# EasyEDA Pro project ProProject_3516_307_8731_devboard_V1.1_2024-05-14.epro, board 3516aio_v1p1
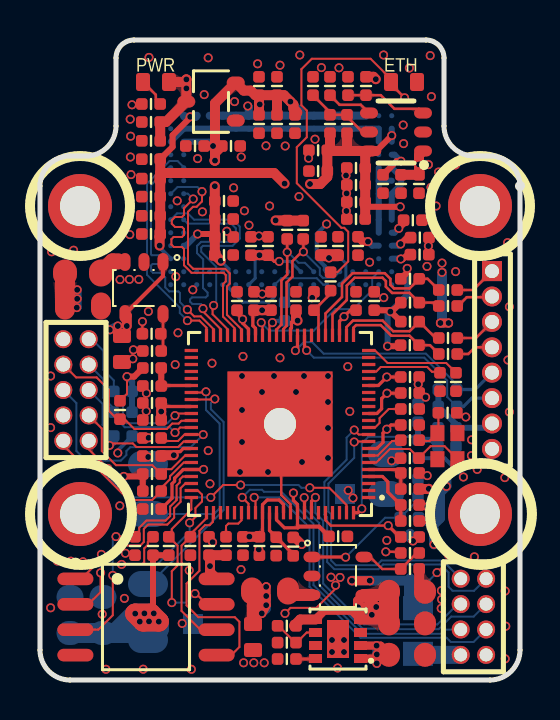
[diagram p1: board, top side]
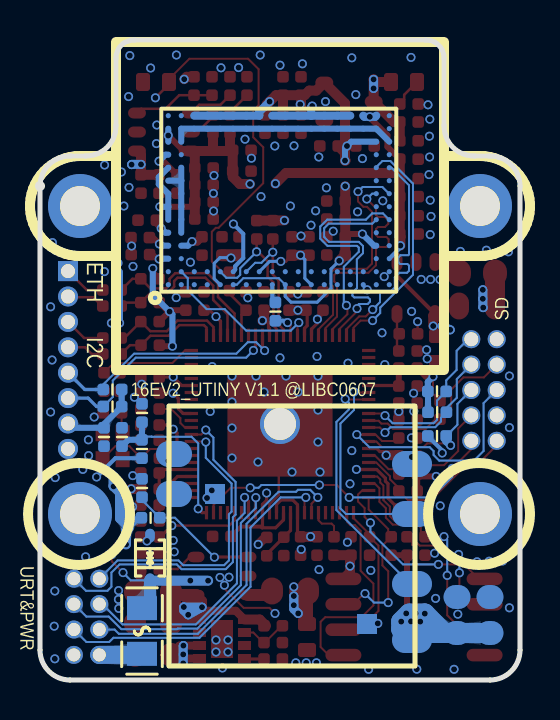
[diagram p2: board, bottom side, seen from below]

Outline 24 x 32 mm; copper layers: Top Layer, Inner1, Inner2, Bottom Layer. Coordinates in mm from the lower left corner of the outline.
Outline path: 0,24.7 arc(0.44,25.76) 1.5,26.2 2.3,26.2 arc(3.36,26.64) 3.8,27.7 3.8,31.1 arc(4.06,31.74) 4.7,32 19.3,32 arc(19.94,31.74) 20.2,31.1 20.2,27.7 arc(20.64,26.64) 21.7,26.2 22.5,26.2 arc(23.56,25.76) 24,24.7 24,1.5 arc(23.56,0.44) 22.5,0 1.5,0 arc(0.44,0.44) 0,1.5 0,24.7
Stack: Top Layer 0.035mm 外层铜厚1oz / Dielectric1 0.2133mm 7628 RC49% 8.6mil / Inner1 0.035mm 内层铜厚 / Dielectric2 0.2133mm 1.1mm H/HOZ 含铜 / Inner2 0.035mm 内层铜厚 / Dielectric3 0.2133mm 7628 RC49% 8.6mil / Bottom Layer 0.035mm 外层铜厚1oz

## Design rules (mm)
template: 自定义配置
spacing copperThickness1oz (default): track to track 0.1, other pairs 0.1 to 0.3
spacing copperThickness2oz: track to track 0.203, other pairs 0.152 to 0.3
track width copperThickness1oz (default): min 0.1, default 0.1, max 2.54
track width copperThickness2oz: min 0.203, default 0.254, max 2.54
differential pair differentialPair (default): width min 0.127, default 0.254, max 2.54; gap min 0.152, default 0.152
via viaSize (default): diameter min 0.45, default 0.5, max 10; hole min 0.3, default 0.305, max 6.3

## Placement (name value [footprint] x y rotation side)
C1  10uF  [0402]  11.55 18.95 90 top
C2  2.2uF  [0402]  18.5 14.35 180 top
C3  2.2uF  [0402]  14.91 7.18 180 top
C5  2.2uF  [0402]  5.6 13.85 0 top
C6  100nF  [0402]  10.7 18.95 270 top
C7  100nF  [0402]  5.6 13 0 top
C8  100nF  [0402]  5.6 8.55 0 top
C9  100nF  [0402]  18.5 10.35 180 top
C10  100nF  [0402]  18.5 8.75 180 top
C11  100nF  [0402]  5.6 11.2 0 top
C12  100nF  [0402]  11.81 6.68 90 top
C13  100nF  [0402]  18.5 15.15 180 top
C14  2.2uF  [0402]  5.6 14.7 0 top
C15  100nF  [0402]  15.8 18.95 270 top
C17  100nF  [0402]  18.5 12.75 180 top
C19  100nF  [0402]  12.8 18.95 270 top
C20  10uF  [0402]  10.97 6.7 270 top
C21  100nF  [0402]  10.15 6.7 90 top
C23  100nF  [0402]  9.85 18.95 270 top
C71  100nF  [0402]  8.45 6.7 270 top
C83  220nF  [0402]  17.15 24.8 90 top
C84  1uF  [0402]  18.99 22.12 180 top
C85  1uF  [0402]  18.64 22.99 180 top
C86  1uF  [0402]  15.9 21.7 90 top
C93  4.7uF  [0402]  9.2 21.25 0 top
C118  18pF  [0402]  14.5 27.8 270 top
C120  10nF  [0402]  14.5 29.7 270 top
C126  100nF  [0402]  10.55 21.7 270 top
C134  4.7uF  [0402]  18.98 21.27 0 top
C136  4.7uF  [0402]  5.55 23.21 180 top
C138  4.7uF  [0402]  15.8 25.6 180 top
C140  4.7uF  [0402]  15.8 23.9 180 top
C148  4.7uF  [0402]  11.4 21.7 90 top
C155  220nF  [0402]  15.4 29.7 270 top
C156  100nF  [0402]  18.05 24.8 90 top
C157  4.7uF  [0402]  18.95 24.8 270 top
C158  100nF  [0402]  13.91 26.48 0 top
C159  4.7uF  [0402]  13.91 25.45 180 top
C160  22uF  [0805#2]  18.35 1.26 0 top
C161  10nF  [0402]  12.34 1.05 0 top
C163  100nF  [0402]  11.85 27.8 90 top
C164  4.7uF  [0402]  10.95 29.7 90 top
C165  4.7uF  [0402]  5.55 27.9 180 top
C166  100nF  [0402]  5.55 26.96 0 top
C167  4.7uF  [0402]  5.55 25.07 180 top
C168  10uF  [0402]  5.55 24.17 180 top
C169  4.7uF  [0402]  7.75 26.7 180 top
C170  4.7uF  [0402]  11.85 29.7 90 top
C172  10nF  [0402]  9.2 22.15 0 top
C173  10nF  [0402]  9.55 26.7 0 top
C174  10uF  [0402]  9.2 23.05 0 top
C175  10nF  [0402]  14.9 21.7 90 top
C176  10uF  [0402]  14.05 21.7 90 top
C177  18pF  [0402]  20.38 13.36 180 top
C178  18pF  [0402]  18.49 11.09 0 top
C183  22uF  [0805#4]  1.5 3.25 90 bottom
C184  22uF  [0805#4]  3.15 3.25 90 bottom
C191  100nF  [0402]  16.71 18.95 90 top
C192  100nF  [0402]  20.4 19.5 0 top
C193  100nF  [0402]  20.4 18.7 0 top
C194  100nF  [0402]  20.4 17.1 0 top
C195  100nF  [0402]  20.4 16.3 0 top
C196  100nF  [0402]  18.5 7.15 0 top
C200  22uF  [0603]  4.1 16.55 90 top
C202  22uF  [0603]  10.65 2.15 90 top
C206  22uF  [0805#2]  18.35 4.41 0 top
C207  22uF  [0805#2]  18.35 2.83 180 top
C208  22uF  [0805]  2.15 18.7 180 top
C209  100nF  [0402]  18.9 13.35 90 bottom
C210  100nF/NC  [0402]  20.8 12.15 90 bottom
C211  100nF  [0402]  18.9 9.6 270 bottom
C212  10nF  [0402]  15.8 24.75 180 top
C213  10nF  [0402]  5.55 22.3 180 top
C214  10nF  [0402]  5.55 26.04 180 top
C215  10nF  [0402]  15.8 23.05 180 top
C216  10nF  [0402]  12.75 27.8 270 top
C217  10nF  [0402]  10.95 27.8 270 top
C218  10nF  [0402]  9.2 23.95 0 top
D2  PESD12VL1BA-N  [sod-323_l1.8-w1.3-ls2.5-bi]  18.5 6.1 270 bottom
F2  BSMD0805-075-12V  [f0805]  18.9 2.45 90 bottom
H1  PM127V-12-08-H43  [hdr-th_8p-p1.27-v-f-r2-c4-s1.27]  21.67 3.16 90 top
L1  -  [0402]  18.5 9.55 180 top
L2  -  [0402]  18.5 7.95 180 top
L3  -  [0402]  12.66 6.67 270 top
L4  -  [0402]  5.6 15.6 180 top
L7  2.2uH  [0805#3]  11.5 4.45 180 top
L8  2.2uH  [0805#4]  2.15 20.35 180 top
LED1  KT-0603R  [0603]  5.8 29.9 0 top
LED2  19-213/Y2C-CQ2R2L/3T(CY)  [0603]  18.2 29.9 180 top
NOREF  -  [Pad_e4285]  12 12.8 90 top
NOREF#2  -  [Pad_e94]  22 8.3 0 top
NOREF#3  -  [Pad_e97]  2 8.3 0 top
R23  4.7kΩ  [0402]  20.8 14.9 90 top
R25  4.7kΩ  [0402]  18.5 13.55 180 top
R27  4.7kΩ  [0402]  5.6 12.1 0 top
R29  4.7kΩ  [0402]  7.52 6.7 90 top
R30  10kΩ  [0402]  9.3 6.7 270 top
R32  4.7kΩ  [0402]  13.7 18.95 270 top
R33  4.7kΩ  [0402]  5.65 6.7 270 top
R34  4.7kΩ  [0402]  6.44 6.7 270 top
R35  4.7kΩ  [0402]  4.75 6.7 90 top
R65  1.5kΩ  [0402]  18.5 11.99 0 top
R74  41.2K  [0402]  15.35 27.8 270 top
R75  30.1K  [0402]  13.65 29.7 270 top
R807  4.7kΩ  [0402]  20 14.9 90 top
R808  4.7kΩ  [0402]  16.3 29.7 270 top
R809  15kΩ  [0402]  12.34 1.87 0 top
R810  47kΩ  [0402]  12.34 2.71 0 top
R811  51kΩ  [0402]  18.5 6.35 180 top
R812  100kΩ  [0402]  18.5 5.55 180 top
R814  100kΩ  [0402]  5.6 16.45 0 top
R815  200kΩ  [0402]  5.58 17.31 180 top
R816  49.9Ω  [0402]  18.5 20.06 0 top
R817  49.9Ω  [0402]  18.5 18.87 0 top
R818  49.9Ω  [0402]  18.5 17.92 0 top
R819  49.9Ω  [0402]  18.49 16.74 0 top
R820  15kΩ  [0402]  19.9 12.15 90 bottom
R821  100kΩ  [0402]  18.9 11.55 270 bottom
R822  1kΩ  [0402]  12.36 22.51 270 top
R823  1kΩ  [0402]  13.16 22.51 270 top
R824  1kΩ/NC  [0402]  20.38 13.67 0 bottom
R825  1kΩ/NC  [0402]  20.38 14.53 0 bottom
R826  4.7kΩ/NC  [0402]  4 13.5 270 top
R827  4.7kΩ/NC  [0402]  4.15 14.43 180 bottom
R828  4.7kΩ/NC  [0402]  5.6 10.3 0 top
R829  4.7kΩ/NC  [0402]  4.15 12.2 180 bottom
R830  4.7kΩ/NC  [0402]  4.14 13.39 180 bottom
R831  4.7kΩ/NC  [0402]  5.6 9.45 0 top
R832  100kΩ  [0402]  18.47 8.11 0 bottom
R833  1kΩ  [0402]  5.55 28.8 180 top
R834  1kΩ  [0402]  14.53 19.93 90 top
R835  49.9Ω  [0402]  12.23 18.42 270 bottom
U1  -  [QFN-88 L9.0-W9.0-P0.35-BL-EP5.26]  12 12.8 90 top
U2  -  [soic-8_l5.3-w5.3-p1.27-ls8.0-bl]  5.3 3.15 270 top
U3  -  [imx307lqd-c__no_ircut]  12 23.7 180 bottom
U11  -  [bl-m8731bu4]  17.55 13.7 180 bottom
U12  TPS82130SILR  [USIP-8_L3.0-W2.8-P0.65-TL-EP]  14.9 2.05 180 top
U13  TPS79301DBVR  [sot-23-6_l2.9-w1.6-p0.95-ls2.8-br]  17.8 27.4 0 top
U14  SY8088AAC  [sot-23-5_l3.0-w1.7-p0.95-ls2.8-br]  14.9 5.2 180 top
U15  SY8088AAC  [sot-23-5_l3.0-w1.7-p0.95-ls2.8-br#2]  5.2 19.6 90 top
U16  ZX-PM1.27-2-5PU  [hdr-th_10p-p1.27-v-f-r2-c5-s1.27]  1.8 14.5 270 top
U17  2343U-108CNG1SNT01  [HDR-TH_8P-P1.27-V-F]  22.6 16 270 top
U18  XC6206P122MR(1uA)  [sot-23-3_l2.9-w1.6-p1.90-ls2.8-br]  8.55 28.92 0 top
X11  24MHz  [CRYSTAL-SMD_4P-L2.0-W1.6-BL]  20.37 11.69 90 top

## Footprints (pads in the part's own frame, mm; a bottom-side part is the same pattern mirrored in y, then rotated)
0402
  custom 0.58x0.58 smd: 1(-0.46,0) 2(0.46,0)
0603
  rrect 0.7x0.9 smd: 1(-0.65,0) 2(0.65,0)
0805
  rrect 1x1.35 smd: 1(-0.9,0) 2(0.9,0)
0805#2
  rrect 1.1x1.2 smd: 1(-0.9,0) 2(0.9,0)
0805#3
  rrect 1.1x1.35 smd: 1(-0.9,0) 2(0.9,0)
0805#4
  rrect 1.2x1.35 smd: 1(-0.9,0) 2(0.9,0)
bl-m8731bu4
  oval 1.8x1.3 smd: 1(0.25,-2.4) 2(0.25,-4.4)
  oval 2x1.3 smd: 3(12.15,-11.7) 4(12.15,-8.9) 5(12.15,-5.4) 6(12.15,-2.9)
  rect 1x1 smd: 7(2.3,-4.4) 8(9.9,-10.9)
CRYSTAL-SMD_4P-L2.0-W1.6-BL
  rect 0.8x0.7 smd: 1(-0.65,-0.5) 2(0.65,-0.5) 3(0.65,0.5) 4(-0.65,0.5)
f0805
  rect 1.2x1.5 smd: 1(-1.143,0) 2(1.143,0)
HDR-TH_8P-P1.27-V-F
  rect 1x1 hole 0.7: 1(-4.445,0)
  round 1 hole 0.7: 2(-3.175,0) 3(-1.905,0) 4(-0.635,0) 5(0.635,0) 6(1.905,0) 7(3.175,0) 8(4.445,0)
hdr-th_8p-p1.27-v-f-r2-c4-s1.27
  round 0.9 hole 0.65: 1(-1.905,-0.635) 2(-1.905,0.635) 3(-0.635,-0.635) 4(-0.635,0.635) 5(0.635,-0.635) 6(0.635,0.635) 7(1.905,-0.635) 8(1.905,0.635)
hdr-th_10p-p1.27-v-f-r2-c5-s1.27
  round 0.9 hole 0.7: 1(-2.54,-0.635) 2(-2.54,0.635) 3(-1.27,-0.635) 4(-1.27,0.635) 5(0,-0.635) 6(0,0.635) 7(1.27,-0.635) 8(1.27,0.635) 9(2.54,-0.635) 10(2.54,0.635)
imx307lqd-c__no_ircut
  round 3.2 hole 2: 0(-10,0) 0(10,0)
  round 0.254 smd: A1(-5.587,-3.934) A2(-5.587,-3.284) A3(-5.587,-2.635) A4(-5.587,-1.984) A5(-5.587,-1.335) A6(-5.587,-0.684) A7(-5.587,-0.035) A8(-5.587,0.616) A9(-5.587,1.266) A10(-5.587,1.915) A11(-5.587,2.566) A12(-5.587,3.216) A13(-5.587,3.865) A14(-5.587,4.516) B1(-4.937,-3.934) B2(-4.937,-3.284) B3(-4.937,-2.635) B4(-4.937,-1.984) B5(-4.937,-1.335) B6(-4.937,-0.684) B7(-4.937,-0.035) B8(-4.937,0.616) B9(-4.937,1.266) B10(-4.937,1.915) B11(-4.937,2.566) B12(-4.937,3.216) B13(-4.937,3.865) B14(-4.937,4.516) C1(-4.287,-3.934) C2(-4.287,-3.284) C13(-4.287,3.865) C14(-4.287,4.516) D1(-3.637,-3.934) D2(-3.637,-3.284) D13(-3.637,3.865) D14(-3.637,4.516) E1(-2.987,-3.934) E2(-2.987,-3.284) E13(-2.987,3.865) E14(-2.987,4.516) F1(-2.337,-3.934) F2(-2.337,-3.284) F13(-2.337,3.865) F14(-2.337,4.516) G1(-1.687,-3.934) G2(-1.687,-3.284) G13(-1.687,3.865) G14(-1.687,4.516) H1(-1.037,-3.934) H2(-1.037,-3.284) H13(-1.037,3.865) H14(-1.037,4.516) J1(-0.387,-3.934) J2(-0.387,-3.284) J13(-0.387,3.865) J14(-0.387,4.516) K1(0.263,-3.934) K2(0.263,-3.284) K13(0.263,3.865) K14(0.263,4.516) L1(0.913,-3.934) L2(0.913,-3.284) L13(0.913,3.865) L14(0.913,4.516) M1(1.563,-3.934) M2(1.563,-3.284) M13(1.563,3.865) M14(1.563,4.516) N1(2.213,-3.934) N2(2.213,-3.284) N13(2.213,3.865) N14(2.213,4.516) P1(2.863,-3.934) P2(2.863,-3.284) P13(2.863,3.865) P14(2.863,4.516) R1(3.513,-3.934) R2(3.513,-3.284) R13(3.513,3.865) R14(3.513,4.516) T1(4.163,-3.934) T2(4.163,-3.284) T13(4.163,3.865) T14(4.163,4.516) U1(4.813,-3.934) U2(4.813,-3.284) U3(4.813,-2.635) U4(4.813,-1.984) U5(4.813,-1.335) U6(4.813,-0.684) U7(4.813,-0.035) U8(4.813,0.616) U9(4.813,1.266) U10(4.813,1.915) U11(4.813,2.566) U12(4.813,3.216) U13(4.813,3.865) U14(4.813,4.516) V1(5.463,-3.934) V2(5.463,-3.284) V3(5.463,-2.635) V4(5.463,-1.984) V5(5.463,-1.335) V6(5.463,-0.684) V7(5.463,-0.035) V8(5.463,0.616) V9(5.463,1.266) V10(5.463,1.915) V11(5.463,2.566) V12(5.463,3.216) V13(5.463,3.865) V14(5.463,4.516)
Pad_e94
  round 3.2 hole 2: 0(0,0)
Pad_e97
  round 3.2 hole 2: 0(0,0)
Pad_e4285
  round 2 hole 1.6: 0(0,0)
QFN-88 L9.0-W9.0-P0.35-BL-EP5.26
  rect 0.16x0.665 smd: 1(-3.675,-4.433) 2(-3.325,-4.433) 3(-2.975,-4.433) 4(-2.625,-4.433) 5(-2.275,-4.433) 6(-1.925,-4.433) 7(-1.575,-4.433) 8(-1.225,-4.433) 9(-0.875,-4.433) 10(-0.525,-4.433) 11(-0.175,-4.433) 12(0.175,-4.433) 13(0.525,-4.433) 14(0.875,-4.433) 15(1.225,-4.433) 16(1.575,-4.433) 17(1.925,-4.433) 18(2.275,-4.433) 19(2.625,-4.433) 20(2.975,-4.433) 21(3.325,-4.433) 22(3.675,-4.433) 45(3.675,4.433) 46(3.325,4.433) 47(2.975,4.433) 48(2.625,4.433) 49(2.275,4.433) 50(1.925,4.433) 51(1.575,4.433) 52(1.225,4.433) 53(0.875,4.433) 54(0.525,4.433) 55(0.175,4.433) 56(-0.175,4.433) 57(-0.525,4.433) 58(-0.875,4.433) 59(-1.225,4.433) 60(-1.575,4.433) 61(-1.925,4.433) 62(-2.275,4.433) 63(-2.625,4.433) 64(-2.975,4.433) 65(-3.325,4.433) 66(-3.675,4.433)
  rect 0.665x0.16 smd: 23(4.433,-3.675) 24(4.433,-3.325) 25(4.433,-2.975) 26(4.433,-2.625) 27(4.433,-2.275) 28(4.433,-1.925) 29(4.433,-1.575) 30(4.433,-1.225) 31(4.433,-0.875) 32(4.433,-0.525) 33(4.433,-0.175) 34(4.433,0.175) 35(4.433,0.525) 36(4.433,0.875) 37(4.433,1.225) 38(4.433,1.575) 39(4.433,1.925) 40(4.433,2.275) 41(4.433,2.625) 42(4.433,2.975) 43(4.433,3.325) 44(4.433,3.675) 67(-4.433,3.675) 68(-4.433,3.325) 69(-4.433,2.975) 70(-4.433,2.625) 71(-4.433,2.275) 72(-4.433,1.925) 73(-4.433,1.575) 74(-4.433,1.225) 75(-4.433,0.875) 76(-4.433,0.525) 77(-4.433,0.175) 78(-4.433,-0.175) 79(-4.433,-0.525) 80(-4.433,-0.875) 81(-4.433,-1.225) 82(-4.433,-1.575) 83(-4.433,-1.925) 84(-4.433,-2.275) 85(-4.433,-2.625) 86(-4.433,-2.975) 87(-4.433,-3.325) 88(-4.433,-3.675)
  rect 5.26x5.26 smd: 89(0,0)
sod-323_l1.8-w1.3-ls2.5-bi
  rrect 0.7x0.49 smd: 1(-1.117,0) 2(1.117,0)
soic-8_l5.3-w5.3-p1.27-ls8.0-bl
  oval 0.63x1.8 smd: 1(-1.905,-3.53) 2(-0.635,-3.53) 3(0.635,-3.53) 4(1.905,-3.53) 5(1.905,3.53) 6(0.635,3.53) 7(-0.635,3.53) 8(-1.905,3.53)
sot-23-3_l2.9-w1.6-p1.90-ls2.8-br
  rrect 0.9x0.6 smd: 1(1.235,-0.95) 2(1.235,0.95) 3(-1.235,0)
sot-23-5_l3.0-w1.7-p0.95-ls2.8-br
  rrect 0.85x0.53 smd: 1(1.3,-0.95) 2(1.3,0) 3(1.3,0.95) 4(-1.3,0.95) 5(-1.3,-0.95)
sot-23-5_l3.0-w1.7-p0.95-ls2.8-br#2
  rrect 0.9x0.55 smd: 1(1.3,-0.95) 2(1.3,0) 3(1.3,0.95) 4(-1.3,0.95) 5(-1.3,-0.95)
sot-23-6_l2.9-w1.6-p0.95-ls2.8-br
  rrect 0.9x0.55 smd: 1(1.35,-0.95) 2(1.35,0) 3(1.35,0.95) 4(-1.35,0.95) 5(-1.35,0) 6(-1.35,-0.95)
USIP-8_L3.0-W2.8-P0.65-TL-EP
  rect 0.65x0.45 smd: 1(-1.125,0.975) 2(-1.125,0.325) 3(-1.125,-0.325) 4(-1.125,-0.975) 5(1.125,-0.975) 6(1.125,-0.325) 7(1.125,0.325) 8(1.125,0.975)
  rect 1.1x1.9 smd: 9(0,0)

## Nets
As in the schematic, except:
GND: C1.2 C2.1 C3.1 C5.1 C6.1 C7.1 C8.1 C9.1 C10.1 C11.1 C12.1 C13.1 C14.1 C15.1 C17.1 C19.1 C20.2 C21.1 C23.1 C71.1 C83.1 C84.1 C85.1 C86.1 C93.2 C120.1 C126.1 C134.2 C136.2 C138.2 C140.2 C148.2 C155.1 C156.1 C157.2 C158.1 C159.2 C160.2 C161.1 C163.1 C164.2 C165.2 C166.1 C167.2 C168.2 C169.2 C170.2 C172.2 C173.2 C174.2 C175.2 C176.2 C177.1 C178.1 C183.2 C184.2 C191.2 C196.2 C200.1 C202.1 C206.2 C207.1 C208.1 C209.2 C210.1 C211.1 C212.2 C213.2 C214.2 C215.2 C216.2 C217.2 C218.2 D2.1 H1.1 LED2.1 NOREF.0 NOREF#2.0 NOREF#3.0 R23.1 R25.1 R27.1 R29.1 R32.1 R35.1 R75.1 R807.1 R809.1 R812.1 R814.1 R820.2 R833.2 U1.45 U1.47 U1.79 U1.89 U2.4 U3.0 U3.A9 U3.B3 U3.B5 U3.B6 U3.B7 U3.B8 U3.B9 U3.B10 U3.B12 U3.B13 U3.C1 U3.C13 U3.D2 U3.D13 U3.E13 U3.F2 U3.F13 U3.G13 U3.H13 U3.J13 U3.K2 U3.K13 U3.L13 U3.M2 U3.M13 U3.N13 U3.P13 U3.R13 U3.T2 U3.T13 U3.U3 U3.U7 U3.U9 U3.U13 U3.V2 U3.V4 U3.V7 U3.V9 U3.V12 U11.1 U11.6 U11.7 U11.8 U12.3 U12.9 U13.2 U14.2 U15.2 U16.7 U17.8 U18.1 X11.2 X11.4

Pads without a net: U1 1 2 3 12 14 15 16 18 20 21 29 46 48 49 69 70 83 85 86; U3 A1 A2 A14 B1 B11 B14 C2 D1 G1 H1 J2 L1 L2 N1 N2 P1 P2 R1 R2 U1 U2 U5 U11 V1 V5 V11 V13 V14; U11 2; U12 7

## Via types
v1: diameter 0.45, hole 0.3, Top Layer to Bottom Layer, 274 vias

## Routing (per net, layer and track width the routed paths; a pad name or vN(x,y) marks a point on that pad's centre or on a via; arc(x,y) is an arc through that point)
0V9: length 69.8
  Top Layer w0.12: R811.2 17.98,6.41 v1(17.29,6.41)
  Top Layer w0.16: U1.37 10.78,17.58 10.64,17.72 10.64,18.43 C6.2 ; v1(12.67,9.35) 12.67,8.98 12.88,8.78 U1.80 12.88,7.63 12.9,7.61 12.22,7.61 11.82,8.01 U1.77 ; U1.13 16.84,13.33 17.08,13.56 17.08,14.07 v1(17.35,14.34) 18.03,14.34 C2.2 ; U1.53 6.24,13.67 C5.2 ; C8.2 6.6,9.09 6.6,9.81 6.73,9.94 6.73,10.09 7.16,10.53 U1.62 8.18,10.53 v1(8.18,10.53)
  Top Layer w0.2: C3.2 13.96,7.67 12.91,7.67 12.88,7.63
  Top Layer w0.45: v1(11.09,3.33) v1(11.31,3.74) 11.31,4.06 10.9,3.65 ; v1(11.31,4.66) v1(11.31,4.2)
  Top Layer w0.5: C7.2 v1(6.06,13.42) C5.2 ; L1.1 19.43,9.55 v1(19.44,9.56) ; C1.1 v1(11.1,18.49) C6.2
  Top Layer w0.6: C202.2 10.65,4.2 10.6,4.25
  Inner2 w0.2: 11.76,5.75 14.29,5.75 15.15,6.61 15.95,6.61 16.15,6.41 v1(17.29,6.41)
  Inner2 w0.5: 7.55,10.58 7.55,9.04 11.31,5.28 v1(11.31,4.66) ; 7.55,10.58 7.6,10.53 v1(8.18,10.53) ; 7.55,10.58 7.55,13.61 7.26,13.9 6.53,13.9 v1(6.06,13.42) ; v1(17.35,14.34) 17.32,14.37 16.57,14.37 16.56,14.38 16.56,16.53 15.8,17.29 12.62,17.29 12.26,17.65 12.26,18.26 12.03,18.49 v1(11.1,18.49)
  Inner2 w0.6: v1(11.09,3.33) 11.31,3.55 v1(11.31,4.2) ; 12.67,9.43 12.67,9.88 13.04,10.25 14.58,10.25 ; v1(19.44,9.56) 17.25,9.56 16.56,10.25
  Inner2 w0.8: 16.56,14.38 16.56,10.25 14.58,10.25 14.5,10.17 14.5,8.81 13.77,8.08 12.97,8.08 11.76,6.87 11.76,5.11 v1(11.31,4.66)
  Bottom Layer w0.45: v1(11.09,3.33) 11.31,3.55 v1(11.31,3.74) v1(11.31,4.2)
1V2_SNS: length 51.8
  Top Layer w0.3: C172.1 8.59,22.3 v1(7.88,22.3) ; 18.44,21.34 18.15,21.05 v1(18.04,21.05)
  Top Layer w0.4: C173.1 v1(8.65,26.7) C169.1
  Top Layer w0.5: v1(8.74,24.69) C218.1 C174.1 C172.1 8.74,21.26 v1(9.04,20.96) ; 12.87,28.38 12.67,28.57 12.67,28.77 v1(12.52,28.92) 12.2,29.24 C170.1 ; C164.1 C217.1 ; 8.72,25.98 8.73,25.97 v1(8.75,25.97) 8.75,26.36 ; C170.1 C163.2 ; C170.1 10.77,29.24 10.54,29.47 10.19,29.47 9.78,29.87 8.75,28.84 8.75,26.36 ; 8.75,26.36 C173.1
  Inner2 w0.3: v1(18.04,21.05) 17.69,21.4 14.98,21.4 10.7,25.68 10.7,28.49 10.91,28.7
  Inner2 w0.45: v1(10.39,28.7) 10.91,28.7 v1(10.99,28.78) ; v1(8.74,24.69) 8.74,25.96 v1(8.75,25.97) 8.75,26.6 v1(8.65,26.7)
  Bottom Layer w0.1: U3.K1 12.06,20.09 13.84,20.09 14.16,19.77 U3.F1
  Bottom Layer w0.15: U3.K1 11.74,19.18 11.45,18.89 10.14,18.89 9.45,19.58 9.45,20.55 v1(9.04,20.96)
  Bottom Layer w0.3: v1(7.88,22.3) 7.3,21.72 U3.U4 ; U3.A3 18.02,21.07 v1(18.04,21.05) ; v1(8.75,25.97) 8.75,26.6 v1(8.65,26.7) 8.44,26.92 U3.U12
  Bottom Layer w0.4: v1(10.39,28.7) 10.44,28.65 U3.M14 ; v1(12.52,28.92) 13.04,28.4 U3.H14 U3.G14 U3.F14 U3.E14 U3.D14 U3.C14 ; U3.M14 U3.N14 U3.P14 U3.R14 ; U3.M14 U3.L14 U3.K14 U3.J14
1V8: length 75.7
  Top Layer w0.127: R815.2 v1(5.12,17.92)
  Top Layer w0.15: v1(11.96,20.93) 11.71,20.93 C148.1
  Top Layer w0.16: C23.2 9.85,18.32 v1(10.13,18.04) 10.13,17.84 10.43,17.55 U1.38 ; U1.78 12.18,8.78 11.95,9 11.36,9 11.12,8.77 U1.75 11.12,7.39 10.91,7.17 v1(10.47,7.17) 10.46,7.16 ; U1.32 12.53,17.56 12.57,17.61 12.57,17.89 12.8,17.89 v1(12.88,17.97)
  Top Layer w0.5: R823.1 R822.1 12.35,22.98 v1(11.78,22.98) ; C148.1 v1(10.97,21.24) C126.2 ; 10.1,7.16 10.9,7.16 ; C19.2 12.8,18.05 v1(12.88,17.97)
  Top Layer w0.6: C176.1 C175.1
  Top Layer w1: L8.2 C208.2
  Inner2 w0.2: v1(1.84,18.62) 4.42,18.62 v1(5.12,17.92)
  Inner2 w0.5: 11.78,21.11 v1(11.96,20.93) 12.02,20.87 12.02,19.51 ; 11.78,21.11 v1(11.78,22.98) ; 11.78,21.11 11.65,21.24 v1(10.97,21.24) 10.11,20.38 10.11,19.51 10.13,19.49 v1(10.13,18.04) ; 14.66,19.75 19.87,19.75 21.53,18.09 21.53,13.89 U17.7 ; v1(12.88,17.97) 12.88,19.46 ; 12.88,19.46 12.83,19.51 ; 12.88,19.46 13.14,19.72 14.45,19.72 v1(14.45,21.1) ; 9.34,19.51 9.36,19.49 9.36,8.28 v1(10.47,7.17)
  Inner2 w0.8: v1(1.86,19.51) 2.08,19.29 7.42,19.29 v1(7.64,19.51) 10.11,19.51 ; 12.02,19.51 12.83,19.51
  Bottom Layer w0.15: U3.T1 7.84,19.71 v1(7.64,19.51) ; U3.H2 12.52,20.93 v1(11.96,20.93) ; v1(14.45,21.1) 14.47,21.12 15,21.12 15.29,20.83 15.29,20.07 U3.E1 ; U3.M1 10.76,20.09 10.76,21.03 v1(10.97,21.24)
  Bottom Layer w0.3: R825.1 R824.1 20.8,12.79 C210.2 22.38,12.61 U17.7
  Bottom Layer w0.45: v1(1.86,19.51) v1(1.86,19.06) 1.86,18.64 v1(1.84,18.62)
2V9_SNS: length 33.6
  Top Layer w0.3: C214.1 6.63,26.66 6.63,27.24 7.51,28.12 v1(7.51,28.16) ; v1(17.59,27.22) 16.81,26.45 ; 16.26,23.66 v1(18.01,23.66)
  Top Layer w0.5: v1(12.23,24.82) 11.7,25.35 6.01,25.35 ; 6.01,25.35 C214.1 6.01,26.09 ; 6.01,25.35 C167.1 C213.1 ; C158.2 14.4,26.45 15.36,26.45 ; C158.2 14.5,26.62 C118.2 ; C158.2 14.37,25.16 14.01,24.8 v1(13.5,24.8) ; 15.36,26.45 U13.6 ; 15.36,26.45 15.35,26.46 R74.2 ; C215.1 C140.1 C212.1 C138.1 16.26,26.26 U13.6 ; 5.98,22.15 6.01,22.18 C213.1 ; 5.98,22.15 v1(5.98,21.72) ; 5.98,22.15 C213.1 ; U13.6 16.81,26.45
  Inner2 w0.45: v1(13.5,24.8) 13.48,24.82 v1(12.23,24.82)
  Bottom Layer w0.2: v1(5.98,21.72) 5.98,21.62 U3.V3
  Bottom Layer w0.3: U3.A10 18.06,25.14 18.06,24.79 U3.A8 U3.A7 ; U3.A12 v1(17.59,27.22) U3.A13 ; v1(18.01,23.66) 17.59,23.66 U3.A7 ; U3.A7 U3.A6
  Bottom Layer w0.4: U3.U14 7.24,28.16 v1(7.51,28.16) 7.78,28.16 U3.T14
3V3: length 176.7
  Top Layer w0.1: v1(4.35,15.17) 4.35,14.31 4.14,14.1
  Top Layer w0.12: v1(17.41,7.72) 14.54,7.72 14.28,7.98 U1.84
  Top Layer w0.16: U1.59 7.16,11.58 7.01,11.42 6.71,11.42 ; C13.2 v1(17.34,15.15) 16.91,14.73 U1.17 ; v1(17.41,7.72) 17.98,7.15 C196.1 ; L2.1 19.24,7.95 v1(19.55,7.64) ; U1.8 16.84,11.58 17.15,11.88 17.15,12.35 v1(17.34,12.54) 17.55,12.75 C17.2 ; C15.2 15.52,18.49 v1(15.2,18.17) 14.97,17.95 U1.25
  Top Layer w0.2: U15.1 6.15,20.2 U15.4
  Top Layer w0.3: R34.2 R33.2 5.65,3.37 v1(5.69,3.33) ; L4.2 4.71,15.17 v1(4.35,15.17) ; R831.1 R828.1 5.02,10.18 v1(4.19,10.18)
  Top Layer w0.4: U12.5 14.21,3.46 15.59,3.46 U12.4
  Top Layer w0.45: v1(20.02,17.85) v1(20.43,17.85) ; L3.1 12.74,7.13 v1(13.09,6.78)
  Top Layer w0.5: 17.28,3.03 16.81,3.49 v1(16.81,3.65) ; 17.28,3.03 17.45,2.85 ; 17.28,3.03 U12.4 16.03,3.52 v1(15.9,3.64) 15.9,3.95 U14.4 ; LED1.2 7.19,29.9 7.31,30.03 ; v1(16.81,3.65) 16.21,4.25 ; v1(16.81,3.65) 16.8,3.64 16.21,3.64 ; v1(6.69,11.24) 6.1,11.24 C11.2 ; U12.5 13.01,3.03 12.7,2.71 ; 7.31,30.03 v1(7.32,30.03) ; 7.31,30.03 U18.3 6.29,27.9 C165.1 6.01,27.05 ; v1(16.79,30.04) 16.67,30.16 R808.1 ; U13.1 18.95,26.25 v1(18.95,25.78) C157.1 C156.2 ; U2.8 8.5,5.39 v1(8.5,5.7) 8.5,6.24 R30.2 ; U15.4 4.34,18.21 v1(4.34,17.7)
  Top Layer w0.6: 17.45,4.4 17.3,4.25 U14.4
  Top Layer w1: 17.45,4.4 17.45,2.85 ; 5.16,2.92 v1(5.94,2.92) 5.54,3.32 v1(4.76,3.32) 5.16,2.92
  Inner1 w0.8: v1(19.55,7.64) 19.55,6.47 18.62,5.54 18.62,4.81 17.46,3.65 v1(16.81,3.65) 16.8,3.64 v1(15.9,3.64) 16.28,3.26 v1(16.59,3.26)
  Inner2 w0.3: 4.57,11.24 4.95,11.62 6.31,11.62 v1(6.69,11.24)
  Inner2 w0.45: v1(20.1,20.85) v1(20.1,20.38) ; 4.35,11.81 v1(3.89,11.35)
  Inner2 w0.5: v1(7.32,30.03) 16.78,30.03 v1(16.79,30.04) 16.79,25.41 16.89,25.31 18.28,25.31 ; v1(17.34,15.15) 17.81,15.15 18.17,14.79 ; 18.17,14.79 18.17,13.37 ; 18.17,14.79 18.17,16.8 17.44,17.53 16.94,17.53 16.3,18.17 v1(15.2,18.17) ; v1(19.42,25.77) 18.74,25.77 18.28,25.31 ; v1(4.34,17.7) 4.15,17.89 2.01,17.89 1.16,17.04 ; 18.28,25.31 18.28,24.24 20.1,22.42 v1(20.1,20.85) ; 18.17,13.37 v1(17.34,12.54) ; 18.17,13.37 20.08,13.37 20.13,13.42
  Inner2 w0.6: 4.57,11.24 4.35,11.46 v1(4.35,15.17) 3.96,15.56 3.96,17.32 v1(4.34,17.7) 3.68,17.7 v1(3.49,17.51)
  Inner2 w0.8: v1(20.02,17.85) 20.13,17.74 20.13,13.42 ; v1(19.55,7.64) 19.47,7.72 v1(17.41,7.72) 15.16,7.72 14.36,6.92 13.23,6.92 v1(13.09,6.78) ; v1(5.94,2.92) 5.94,3.08 v1(5.69,3.33) 5.68,3.32 v1(4.76,3.32) 4.99,3.09 v1(4.99,2.92) v1(5.94,2.92) ; v1(5.94,2.92) 7.05,1.81 12.85,1.81 13.94,2.9 16.14,2.9 16.71,3.47 16.71,3.65 13.92,3.65 12.38,2.11 9.64,2.11 9.64,4.35 4.16,9.83 4.16,10.83 4.57,11.24 ; 20.32,13.14 v1(20.32,10.17)
  Bottom Layer w0.2: v1(3.89,11.35) 3.89,11.48 R829.1
  Bottom Layer w0.3: R832.2 19.08,8.11 v1(19.55,7.64) ; v1(4.35,15.17) 4.61,14.91 R827.1 4.6,14.42 R830.1
  Bottom Layer w0.45: v1(18.95,25.78) 19.41,25.78 v1(19.42,25.77) ; v1(7.32,30.03) v1(7.32,29.58) ; v1(3.49,17.51) v1(3.89,17.7) ; 16.8,3.64 v1(16.81,3.65) 16.81,3.48 v1(16.59,3.26) v1(15.9,3.64) 16.8,3.64
  Bottom Layer w0.5: v1(20.32,10.17) 20.32,9.7 ; 20.32,9.7 v1(20.32,9.68) ; 20.32,9.7 20,9.38 20,8.09 v1(19.55,7.64) 19.7,7.49 v1(19.7,6.78) ; 20.09,17.85 20.1,17.86 v1(20.1,20.38)
  Bottom Layer w1: v1(4.76,3.32) 5.54,3.32 v1(5.94,2.92) 5.94,2.54 U11.3 ; v1(4.76,3.32) 3.79,2.35 ; v1(4.76,3.32) 5.4,2.68 U11.3 ; U11.3 5.05,2.35 3.79,2.35 ; C183.1 C184.1 3.79,2.35
  vias: v1(5.22,3.33) v1(5.45,2.93) v1(19.71,7.23)
AVDD33_DDR_PLL: length 2.6
  Top Layer w0.16: U1.76 11.47,7.48 C12.2 12.66,6.29 L3.2
AVDD33_PLL: length 3.3
  Top Layer w0.16: U1.4 17.12,10.17 17.39,9.91 17.39,9.4 C10.2 L2.2
AVDD_PLL: length 2.5
  Top Layer w0.16: L1.2 C9.2 17.87,10.53 U1.5
GND: length 27.1
  Top Layer w0.1: v1(14.78,4.74) 14.78,4.57 13.81,3.61 12.53,3.61 v1(12.25,3.33)
  Top Layer w0.12: U1.79 12.53,8.78 12.06,9.25 12.06,12.74 U1.89
  Top Layer w0.5: R812.1 18.96,4.69 19.25,4.4
  Bottom Layer w0.2: U3.F2 14.24,20.51 14.24,20.69 13.84,21.1 13.84,22.31 v1(14.33,22.8)
  Bottom Layer w0.3: U3.B12 U3.B13 U3.C13 U3.D13 U3.E13 U3.F13 U3.G13 U3.H13 U3.J13 U3.K13 U3.L13 U3.M13 U3.N13 U3.P13 U3.R13 U3.T13 U3.U13 U3.V12 ; U3.B9 U3.B8 U3.B7 U3.B6 U3.B5 ; U3.B9 U3.B10 ; U3.B9 U3.A9
  vias: v1(0.53,15.2) v1(0.53,12.62) v1(0.53,3.61) v1(0.58,21.41) v1(0.74,10.51) v1(0.87,5.95) v1(1.54,5.94) v1(1.68,21.49) v1(2.15,5.91) v1(2.98,21.43) v1(3.11,3.29) v1(3.3,0.53) v1(4,20.02) v1(3.99,8.71) v1(4.22,4.08) v1(4.27,6.34) v1(4.45,23.18) v1(4.51,28.04) v1(4.53,27.19) v1(4.52,26.15) v1(4.49,23.99) v1(4.49,22.27) v1(4.47,20.03) v1(4.6,28.76) v1(4.55,25.27) v1(4.64,16.06) v1(4.67,16.51) v1(4.94,20.03) v1(5.16,0.54) v1(5.32,14.34) v1(5.31,13.44) v1(5.45,31.13) v1(5.42,18.43) v1(5.43,12.11) v1(5.41,11.15) v1(6.79,20.17) v1(6.76,15.77) v1(6.86,23.96) v1(6.9,17.36) v1(7.11,2.83) v1(7.46,5.48) v1(7.57,0.53) v1(7.88,26.07) v1(8.12,23.41) v1(8.21,29.27) v1(8.41,31.11) v1(8.41,11.47) v1(8.5,9.81) v1(8.6,15.84) v1(8.63,6.89) v1(9.34,22.44) v1(9.73,28.92) v1(9.68,24.61) v1(10,10.4) v1(10.06,26.15) v1(10.1,15.2) v1(10.1,13.5) v1(10.1,11.9) v1(10.05,5.52) v1(10.22,23.46) v1(10.15,16.18) v1(10.18,0.86) v1(10.45,22.74) v1(10.69,0.86) v1(10.88,30.81) v1(10.95,22.2) v1(10.94,6.53) v1(11.11,19.3) v1(11.1,14.4) v1(11.21,0.86) v1(11.3,26.71) v1(11.4,10.4) v1(11.48,23.7) v1(11.7,15.2) v1(12,30.74) v1(12,16.11) v1(12.26,26.7) v1(12.8,14.4) v1(12.95,24.17) v1(12.99,31.25) v1(13.1,10.9) v1(13.2,15.2) v1(13.43,26.09) v1(13.61,19.11) v1(13.75,27.04) v1(14.07,30.62) v1(14.4,15.2) v1(14.4,13.9) v1(14.4,12.6) v1(14.4,11.1) v1(14.55,5.14) v1(14.6,2) v1(14.6,1.4) v1(14.95,30.61) v1(14.88,0.6) v1(15,5.13) v1(15.2,2) v1(15.2,1.4) v1(15.3,25.23) v1(15.33,24.33) v1(15.32,23.45) v1(15.39,15.67) v1(15.41,9.48) v1(15.49,13.43) v1(15.65,9.1) v1(16.48,20.89) v1(17.18,31.25) v1(17.19,19.12) v1(17.34,6.98) v1(17.58,10.96) v1(18.16,27.75) v1(18.18,26.82) v1(18.47,30.6) v1(18.65,6.95) v1(18.91,14.79) v1(19.35,20.68) v1(19.28,14.14) v1(19.42,21.7) v1(19.36,10.22) v1(19.37,8.66) v1(19.51,31.22) v1(19.57,29.17) v1(19.55,24.63) v1(19.81,23.7) v1(19.93,25.4) v1(20.07,4.47) v1(20.08,4.03) v1(20.06,3.58) v1(20.77,25.75) v1(20.78,20.42) v1(21.29,13.15) v1(21.58,12.01) v1(21.57,11.22) v1(21.72,6.16) v1(21.86,10.53) v1(23.24,10.12) v1(23.26,4.45) v1(23.29,2.69) v1(23.26,1.06) v1(23.38,21.87) v1(23.4,16) v1(23.47,18.66) v1(23.47,13.4)
VIN: length 25
  Top Layer w0.1: v1(20.41,6.27) 20.41,5.93 v1(19.85,5.37)
  Top Layer w0.4: U12.1 17.22,1.08 17.45,1.3 17.03,1.72 v1(16.83,1.72) 16.03,1.72 U12.2
  Top Layer w0.45: v1(16.49,4.97) 16.48,4.97 v1(15.59,4.97)
  Inner1 w0.2: v1(20.41,6.27) 20.16,6.52 20.16,7.9 19.89,8.17 19.89,10.4 20.09,10.6 20.72,10.6 v1(21.17,10.15)
  Inner2 w0.8: v1(16.49,4.97) 17.12,4.97 17.61,4.48 17.61,2.85 16.84,2.08 16.84,1.71
  Bottom Layer w0.1: D2.2 19.46,4.98 v1(19.85,5.37)
  Bottom Layer w0.2: v1(21.17,10.15) 20.23,11.09 R821.2
  Bottom Layer w0.45: v1(16.84,0.83) v1(16.84,1.28) 16.84,1.71 v1(16.83,1.72)
  Bottom Layer w0.5: D2.2 18.48,4.97 v1(15.59,4.97)
  Bottom Layer w0.6: F2.2 18.5,3.99 D2.2
VIN_CON: length 2.2
  Bottom Layer w0.9: 21.03,1.26 18.95,1.26 F2.1
ADC1: length 15.6
  Top Layer w0.1: v1(8.54,9.13) 9.16,9.75 v1(10.03,9.75) ; v1(13.49,9.61) 14.47,9.61 15.32,8.75 U1.87 ; v1(3.39,10.58) 2.44,11.53 U16.10
  Bottom Layer w0.1: v1(10.03,9.75) 12.93,9.75 13.07,9.61 v1(13.49,9.61) ; v1(3.39,10.58) 3.39,10.16 4.42,9.13 v1(8.54,9.13)
ADC_CH0: length 8.8
  Top Layer w0.16: U1.88 15.9,8.37 v1(16.09,8.56)
  Bottom Layer w0.1: v1(16.09,8.56) 16.09,11.83 16.42,12.16 18.41,12.16 18.42,12.17 18.74,12.17 R821.1
  Bottom Layer w0.3: R820.1 19.58,12.01 R821.1 C209.1
BOOT_SEL0: length 4.8
  Top Layer w0.1: 16.43,16.48 16.75,16.48 17.38,15.85 20.31,15.85 R23.2
BOOT_SEL1: length 3.8
  Top Layer w0.1: 20,15.41 19.6,15.41 19.36,15.65 17.04,15.65 16.81,15.42 U1.19
DC0V9_EN: length 6.6
  Top Layer w0.16: v1(15.28,6.14) 15.27,6.15 U14.1
  Bottom Layer w0.1: C211.2 18.9,9 R832.1 17.25,8.11 v1(15.28,6.14)
DC0V9_FB: length 3.3
  Top Layer w0.12: R811.1 18.84,6.35 R812.2 17.11,5.55 16.51,6.15 U14.5
DC0V9_LX: length 1.2
  Top Layer w0.6: U14.3 12.4,4.25
DC1V8_FB: length 1.9
  Top Layer w0.127: U15.5 6.15,16.54 R814.2
DC1V8_LX: length 1.1
  Top Layer w0.8: 3.91,20.93 3.63,20.93 L8.1
ETH_1: length 2.1
  Top Layer w0.127: C192.2 21.66,19.5 U17.1
ETH_2: length 1.9
  Top Layer w0.127: C193.2 20.9,18.7 21.34,19.14 22.56,19.14 U17.2
ETH_3: length 2.1
  Top Layer w0.127: C194.2 21.79,17.1 U17.3
ETH_6: length 1.9
  Top Layer w0.127: U17.4 21.75,16.64 21.41,16.3 C195.2
ETH_MDI_AN: length 8.3
  Top Layer w0.127: U1.26 14.62,18.28 15.34,19 15.34,19.72 15.73,20.11 17.12,20.11 17.29,19.94 17.29,19.67 17.61,19.35 18.48,19.35 R817.2 19.77,18.87 C193.1
ETH_MDI_AP: length 8.9
  Top Layer w0.127: C192.1 19.38,20.06 R816.2 18.48,19.58 17.7,19.58 17.52,19.76 17.52,20.06 17.24,20.34 15.63,20.34 15.1,19.81 15.1,19.15 14.28,18.33 U1.27
ETH_MDI_BN: length 5.3
  Top Layer w0.127: C195.1 19.5,16.74 R819.2 18.48,17.21 17.57,17.21 17.04,17.74 15.8,17.74 15.68,17.62 U1.23
ETH_MDI_BP: length 5.9
  Top Layer w0.127: U1.24 15.32,17.64 15.65,17.97 17.13,17.97 17.66,17.44 18.48,17.44 R818.2 19.78,17.1 C194.1
I2C0_SCL: length 6.8
  Top Layer w0.127: R822.2 v1(12.36,21.39) 12.36,20.27 12.07,19.98 12.07,17.77 11.82,17.53 U1.34
  Bottom Layer w0.1: v1(12.36,21.39) 12.4,21.39 12.93,20.86 13.24,20.86 U3.G2
I2C0_SDA: length 8
  Top Layer w0.127: U1.33 12.18,17.56 12.33,17.71 12.33,19.88 12.62,20.17 12.62,20.94 13.09,21.41 v1(13.17,21.41) 13.17,22.04 R823.2
  Bottom Layer w0.1: v1(13.17,21.41) 13.99,20.59 13.99,20.26 14.14,20.11 14.68,20.11 U3.E2
I2C2_SCL: length 11.9
  Top Layer w0.16: v1(13.33,16.48) 13.22,16.59 U1.30
  Bottom Layer w0.1: R824.2 20.36,14.15 20.36,14.97 19.21,16.12 13.69,16.12 v1(13.33,16.48)
  Bottom Layer w0.16: R824.2 21.18,13.67 21.59,14.09 U17.6
I2C2_SDA: length 12.3
  Top Layer w0.16: v1(12.77,16.47) 12.88,16.58 U1.31
  Bottom Layer w0.1: v1(12.77,16.47) 13.19,16.89 13.61,16.89 14.18,16.32 19.3,16.32 20.84,14.78 R825.2
  Bottom Layer w0.16: U17.5 21.76,14.53 R825.2
MIPI_RX_CK0N: length 11.6
  Top Layer w0.1: v1(7.66,24.05) 7.2,23.59 7.2,23.25 7.1,23.15 6.75,23.15 6.59,22.99 6.59,22.81 6.75,22.65 7.1,22.65 7.2,22.55 7.2,22.25 7.1,22.15 6.68,22.15 6.57,22.04 6.57,21.77 6.69,21.65 7.1,21.65 7.2,21.55 7.2,20.74 7.58,20.36 9.18,20.36 9.29,20.25 9.29,19.93 9.15,19.79 9.15,18.17 9.72,17.59 U1.40
  Bottom Layer w0.1: v1(7.66,24.05) 7.39,24.32 U3.U8
MIPI_RX_CK0P: length 11.5
  Top Layer w0.1: U1.39 10.07,17.53 9.35,18.26 9.35,19.68 9.49,19.82 9.49,20.33 9.26,20.56 7.66,20.56 7.4,20.82 7.4,23.41 7.65,23.66 7.83,23.66 8.1,23.93 v1(8.1,24.42)
  Bottom Layer w0.1: U3.V8 6.55,24.32 6.88,24.65 7.87,24.65 v1(8.1,24.42)
MIPI_RX_D0N: length 11.7
  Top Layer w0.1: U1.42 9.03,17.55 8.15,18.43 v1(8.15,18.57)
  Bottom Layer w0.1: U3.U6 7.39,22.82 9.56,22.82 9.79,22.59 9.79,22.15 9.54,21.91 8.06,21.91 7.85,21.7 7.85,21.34 8.16,21.03 8.16,20.29 8.15,20.28 8.15,19.6 8.38,19.37 8.38,19.22 8.29,19.13 7.6,19.13 7.5,19.03 7.5,18.92 7.62,18.8 8.05,18.8 8.15,18.7 v1(8.15,18.57)
MIPI_RX_D0P: length 11.7
  Top Layer w0.1: U1.41 9.38,17.55 8.63,18.29 8.63,18.76 ; 8.63,18.76 8.65,18.76 v1(8.68,18.73) ; 8.63,18.76 8.63,18.77
  Bottom Layer w0.1: U3.V6 6.85,23.33 7.39,23.33 7.7,23.02 9.64,23.02 9.99,22.67 9.99,22.07 9.63,21.71 8.15,21.71 8.06,21.62 8.06,21.41 8.81,20.66 8.81,18.86 v1(8.68,18.73)
MIPI_RX_D2N: length 11.6
  Top Layer w0.1: v1(7.37,17.97) 7.97,17.97 8.32,17.61 U1.44
  Bottom Layer w0.1: v1(7.37,17.97) 6.99,18.35 6.99,18.62 5.35,20.26 5.35,24.82 6.48,25.95 6.88,25.95 7.19,25.64 U3.U10
MIPI_RX_D2P: length 11.6
  Top Layer w0.1: v1(7.37,18.52) 7.71,18.18 8.04,18.18 8.68,17.55 U1.43
  Bottom Layer w0.1: U3.V10 6.43,25.62 5.55,24.74 5.55,21.28 5.59,21.24 5.97,21.24 6.09,21.12 6.09,20.9 5.99,20.8 5.63,20.8 5.55,20.72 5.55,20.46 5.65,20.36 6.03,20.36 6.26,20.13 6.26,19.63 6.46,19.43 6.92,19.43 7,19.35 7,18.89 7.19,18.7 7.19,18.52
SDIO0_CARD_DETECT: length 8.7
  Top Layer w0.1: U1.61 7.19,10.88 6.5,10.19 6.5,10.04 6.06,9.6 R831.2 5.61,9 4.44,9 2.72,10.72 2.18,10.72 1.16,11.73 1.16,11.96
SDIO0_CCLK_OUT: length 12.8
  Top Layer w0.1: R27.2 6.21,11.95 6.9,11.95 7.22,12.28 8.16,12.28 v1(8.16,12.27)
  Bottom Layer w0.1: 1.16,14.5 1.82,13.84 1.82,11.45 2.3,10.97 4.04,10.97 4.32,11.25 4.32,11.45 4.51,11.64 7.53,11.64 v1(8.16,12.27)
SDIO0_CCMD: length 7.4
  Top Layer w0.1: U1.56 7,12.62 v1(6.75,12.37)
  Bottom Layer w0.1: U16.4 3.16,15.05 3.16,14.11 3.68,13.59 R830.2 3.95,13.12 3.95,12.93 4.24,12.64 6.48,12.64 v1(6.75,12.37)
SDIO0_CDATA0: length 7.7
  Top Layer w0.1: U1.58 7.19,11.92 6.91,11.65 4.82,11.65 4.64,11.83 3.57,11.83 v1(3.47,11.73)
  Bottom Layer w0.1: U16.6 3.13,13.81 3.13,12.76 R829.2
  Bottom Layer w0.4: v1(3.47,11.73) 3.69,11.95 R829.2
SDIO0_CDATA1: length 7.4
  Top Layer w0.1: U16.8 3.09,12.58 3.09,11.45 3.8,10.74 5.62,10.74 R828.2 6.3,10.54 6.57,10.54 7.25,11.23 U1.60
SDIO0_CDATA2: length 8.5
  Top Layer w0.1: v1(6.75,13.22) 6.85,13.33 U1.54
  Bottom Layer w0.1: v1(6.75,13.22) 6.37,12.84 4.32,12.84 4.15,13.01 4.15,13.97 R827.2 3.69,14.98 3.17,15.5 3.17,16.46 2.59,17.04 U16.2
SDIO0_CDATA3: length 8.5
  Top Layer w0.1: 1.16,15.77 1.81,15.13 2.83,15.13 3.44,14.52 3.44,13.46 3.86,13.04 R826.2 4.23,13.04 4.72,12.55 6.34,12.55 6.61,12.82 6.93,12.82 7.07,12.96 7.55,12.96 7.57,12.98
SENSOR_CLK: length 1.5
  Top Layer w0.1: v1(11.62,17.87) 11.47,17.73 U1.35
  Bottom Layer w0.1: 11.49,17.89 11.51,17.87 v1(11.62,17.87)
  Bottom Layer w0.2: v1(11.62,17.87) 11.71,17.96 R835.2
SENSOR_RSTN: length 8.3
  Top Layer w0.1: v1(11.06,17.87) 11.12,17.81 U1.36
  Bottom Layer w0.1: v1(11.06,17.87) 11.46,17.47 13.69,17.47 14.76,18.54 15.66,18.54 16.61,19.49 16.61,20.09 U3.B2
SFC_BOOT_MODE: length 2.1
  Top Layer w0.1: U1.11 16.75,12.62 16.98,12.85 16.98,13.09 17.44,13.55 R25.2
SFC_CLK: length 7.6
  Top Layer w0.1: U1.67 8.32,8.09 7.52,7.29 R29.2 7.08,6.72 7.08,3.45 8.01,2.52 U2.6
SFC_CSN: length 12.1
  Top Layer w0.1: U2.1 2.06,5.06 2.79,5.78 v1(4.08,5.78) 5.11,5.78 5.21,5.88 5.21,6.58 5.39,6.76 5.39,6.9 R33.1 ; 7.57,9.48 7.9,9.48 8.1,9.27 8.1,8.92 7.77,8.59 7.77,8.15 v1(7.48,7.86)
  Bottom Layer w0.1: v1(4.08,5.78) 5.85,5.78 7.48,7.41 v1(7.48,7.86) 7.47,7.86
SFC_HOLD_IO3: length 8.6
  Top Layer w0.1: U1.66 7.57,8.53 6.59,7.55 6.59,7.16 ; R34.1 6.88,6.72 6.88,5.73 6.59,5.44 v1(6.59,3.87) ; v1(7.75,4.32) 7.8,4.32 8.34,3.78 8.83,3.78
  Bottom Layer w0.1: v1(7.75,4.32) 7.3,3.87 v1(6.59,3.87)
SFC_MISO_IO1: length 10.4
  Top Layer w0.1: v1(3.03,5.36) 3.03,4.4 2.41,3.78 1.77,3.78 ; v1(3.07,6.28) 3.47,6.28 3.91,6.72 5.01,6.72 5.19,6.9 5.19,7.56 5.4,7.77 6.36,7.77 6.71,8.11 6.71,8.59 7.03,8.91 7.03,9.59 7.26,9.83 U1.64
  Bottom Layer w0.1: v1(3.07,6.28) 3.03,6.24 v1(3.03,5.36)
SFC_MOSI_IO0: length 10.9
  Top Layer w0.1: U2.5 9.56,1.25 9.97,1.65 9.97,2.91 9.74,3.14 7.92,3.14 7.33,3.73 7.33,4.82 7.97,5.46 7.97,7.46 8.25,7.74 8.48,7.74 8.64,7.9 8.64,8.33 U1.68
SFC_WP_IO2: length 12.1
  Top Layer w0.1: U1.63 7.14,10.17 6.99,10.03 6.99,9.88 6.83,9.72 6.83,9.05 6.83,9.05 6.83,9 6.51,8.67 6.51,8.2 6.28,7.97 5.32,7.97 4.96,7.61 4.96,7.37 R35.2 4.74,7.17 v1(3.8,7.17) ; v1(3.64,5.23) 3.64,3.24 2.91,2.52 U2.3
  Bottom Layer w0.1: v1(3.8,7.17) 3.64,7.01 v1(3.64,5.23)
TEST_MODE: length 2.7
  Top Layer w0.127: R834.1 14.53,19.32 R32.2 13.93,18.27 U1.28
UART0_RXD: length 17.5
  Top Layer w0.1: U1.74 10.78,9.06 v1(10.71,9.13)
  Bottom Layer w0.1: 10.62,9.11 10.64,9.13 v1(10.71,9.13) 11.97,9.13 13.47,7.63 13.47,4.66 16.03,2.11 20.33,2.11 20.54,1.9 21.68,1.9 H1.3
UART0_TXD: length 16.8
  Top Layer w0.1: v1(10.11,9.13) 10.43,8.81 U1.73
  Bottom Layer w0.1: H1.4 21.03,2.52 20.27,2.52 20.06,2.31 16.11,2.31 13.67,4.75 13.67,7.81 12.07,9.41 11.2,9.41 11.1,9.51 10.49,9.51 v1(10.11,9.13)
UART1_RXD: length 17.5
  Top Layer w0.1: 16.43,12.28 15.94,12.28 v1(15.71,12.5)
  Bottom Layer w0.1: H1.7 21.7,4.46 20.63,4.46 20.43,4.66 20.43,5.37 20.02,5.78 17.16,5.78 16.92,5.54 14.71,5.54 14.36,5.9 14.36,8.13 14.22,8.27 14.22,9.9 15.33,11.01 15.33,12.12 v1(15.71,12.5)
UART1_TXD: length 14.3
  Top Layer w0.1: U1.9 15.74,11.92 v1(15.71,11.9)
  Bottom Layer w0.1: v1(15.71,11.9) 15.71,11.11 14.42,9.82 14.42,8.42 14.55,8.29 14.55,5.98 14.79,5.74 16.84,5.74 17.08,5.98 20.12,5.98 H1.8
UART2_RXD: length 15.2
  Top Layer w0.16: U1.81 13.22,9.11 v1(13.21,9.12)
  Bottom Layer w0.1: v1(13.21,9.12) 13.21,8.6 13.96,7.85 13.96,4.74 16.13,2.57 17.12,2.57 17.15,2.54 19.93,2.54 20.56,3.17 21.68,3.17 H1.5
UART2_TXD: length 13.5
  Top Layer w0.16: v1(13.77,9.13) 13.57,8.94 U1.82
  Bottom Layer w0.1: v1(13.77,9.13) 13.77,8.35 14.16,7.96 14.16,4.82 16.2,2.78 19.87,2.78 20.88,3.8 H1.6
UPDATE_MODE: length 1.8
  Top Layer w0.1: U1.72 10.07,7.98 9.91,7.82 9.42,7.82 9.3,7.7 R30.1
USB_DM: length 12.4
  Top Layer w0.1: v1(8.74,14.05) 8.72,14.03 U1.52 7.58,14.04
  Bottom Layer w0.1: v1(8.74,14.05) 8.55,13.86 8.55,13.54 9.18,12.9 9.18,8.5 5.48,4.8 U11.4
USB_DP: length 10.6
  Top Layer w0.1: v1(8.3,14.41) 8.26,14.38 U1.51
  Bottom Layer w0.1: v1(8.3,14.41) 8.3,13.5 8.98,12.82 8.98,8.58 8.7,8.3 U11.5
$1N2212: length 2.1
  Top Layer w0.1: C177.2 19.92,12.39 X11.3 19.48,11.95 18.96,11.95
$1N2213: length 1.9
  Top Layer w0.1: 18.04,11.95 17.61,11.95 16.88,11.23 U1.7
$1N2223: length 5.4
  Top Layer w0.1: C178.2 18.49,11.55 17.49,11.55 16.97,11.03 16.97,11.03 16.81,10.88 U1.6 ; 18.95,11.11 19.53,11.69 20.23,11.69 20.87,11.05 X11.1
$1N8351: length 1.2
  Top Layer w0.4: v1(16.4,21.92) 16.14,21.92 C86.2
  Bottom Layer w0.3: U3.B4 16.6,21.72 v1(16.4,21.92)
$1N8352: length 1.8
  Top Layer w0.3: v1(18.05,25.94) 17.83,25.94 C83.2
  Bottom Layer w0.3: v1(18.05,25.94) 17.72,26.27 U3.A11
$1N8353: length 1
  Top Layer w0.3: v1(17.94,22.58) 18.18,22.82 C85.2
  Bottom Layer w0.3: v1(17.94,22.58) 17.73,22.37 U3.A5
$1N8354: length 1.1
  Top Layer w0.3: 18.45,22.19 18.42,22.19 v1(18.03,21.8)
  Bottom Layer w0.3: U3.A4 17.95,21.72 v1(18.03,21.8)
$1N8385: length 1
  Bottom Layer w0.2: U3.J1 12.39,19.04 R835.1
$1N8396: length 4.1
  Top Layer w0.127: U13.3 18.94,28.56 17.72,28.56 17.04,29.24 R808.2 C155.2
$1N8404: length 3.7
  Top Layer w0.127: U13.5 16.12,27.4 15.35,28.17 R74.1 C118.1 14.5,28.39 R75.2
$1N8406: length 2.3
  Top Layer w0.127: U13.4 16.04,28.76 14.98,28.76 C120.2
$1N12820: length 2.4
  Top Layer w0.16: U1.50 6.09,14.73 C14.2
  Top Layer w0.3: L4.1 C14.2
$1N13177: length 1.1
  Top Layer w0.16: 12.71,1.05 13.75,1.05 U12.8
$1N13350: length 2.5
  Top Layer w0.1: U12.6 13.34,2.38 12.87,1.91 12.72,1.91 11.92,2.71 11.78,2.71
$1N16495: length 7.9
  Top Layer w0.3: 17.54,18.42 17.59,18.42 R817.1 ; 17.54,18.42 v1(17.52,18.42) ; 17.54,18.42 R818.1 ; R819.1 17.98,16.69 v1(17.38,16.69) ; v1(17.52,18.42) 17.45,18.49 C191.1 ; v1(17.52,18.42) 17.51,18.42 ; R816.1 18.36,20.38 v1(18.36,20.58)
  Bottom Layer w0.3: v1(18.36,20.58) 18.36,19.26 v1(17.52,18.42) 17.38,18.28 v1(17.38,16.69)
$1N26063: length 1.5
  Top Layer w0.127: LED1.1 5.79,29.26 5.79,29.02 R833.1
$1N26212: length 18.5
  Top Layer w0.1: LED2.2 17.55,30.04 16.53,31.06 13.59,31.06 13.07,30.54 13.07,28.74 13.34,28.47 13.34,27.14 12.84,26.64 12.84,24.84 15.07,22.61 15.21,22.61 15.41,22.41 15.41,20.93 14.87,20.39 R834.2
  Top Layer w0.127: v1(18.23,29.11) 17.55,29.79 LED2.2

## Copper pours and planes (outline as drawn; the poured copper is in the pictures)
GND on Top Layer: -6.52,36.68 29.75,36.68 29.75,-4.77 -6.52,-4.77
GND on Bottom Layer: -9.08,38.44 31.03,38.44 31.03,-6.85 -9.08,-6.85
GND on Inner1: -4.96,35.15 28.4,35.15 28.4,-3.44 -4.96,-3.44
GND on Inner2: -3.93,34.09 27.15,34.09 27.15,-2 -3.93,-2

Small or netless copper shapes (teardrops, artwork), in the pictures only: 356 on Top Layer, 145 on Bottom Layer, 2 on Inner1, 28 on Inner2

## Text on the board
Bottom Silkscreen Layer: 16EV2_UTINY V1.1 @LIBC0607 | URT&PWR | SD | ETH | I2C
Top Silkscreen Layer: PWR | ETH
